# EAGLE design SingleDice (EAGLE 5.11)
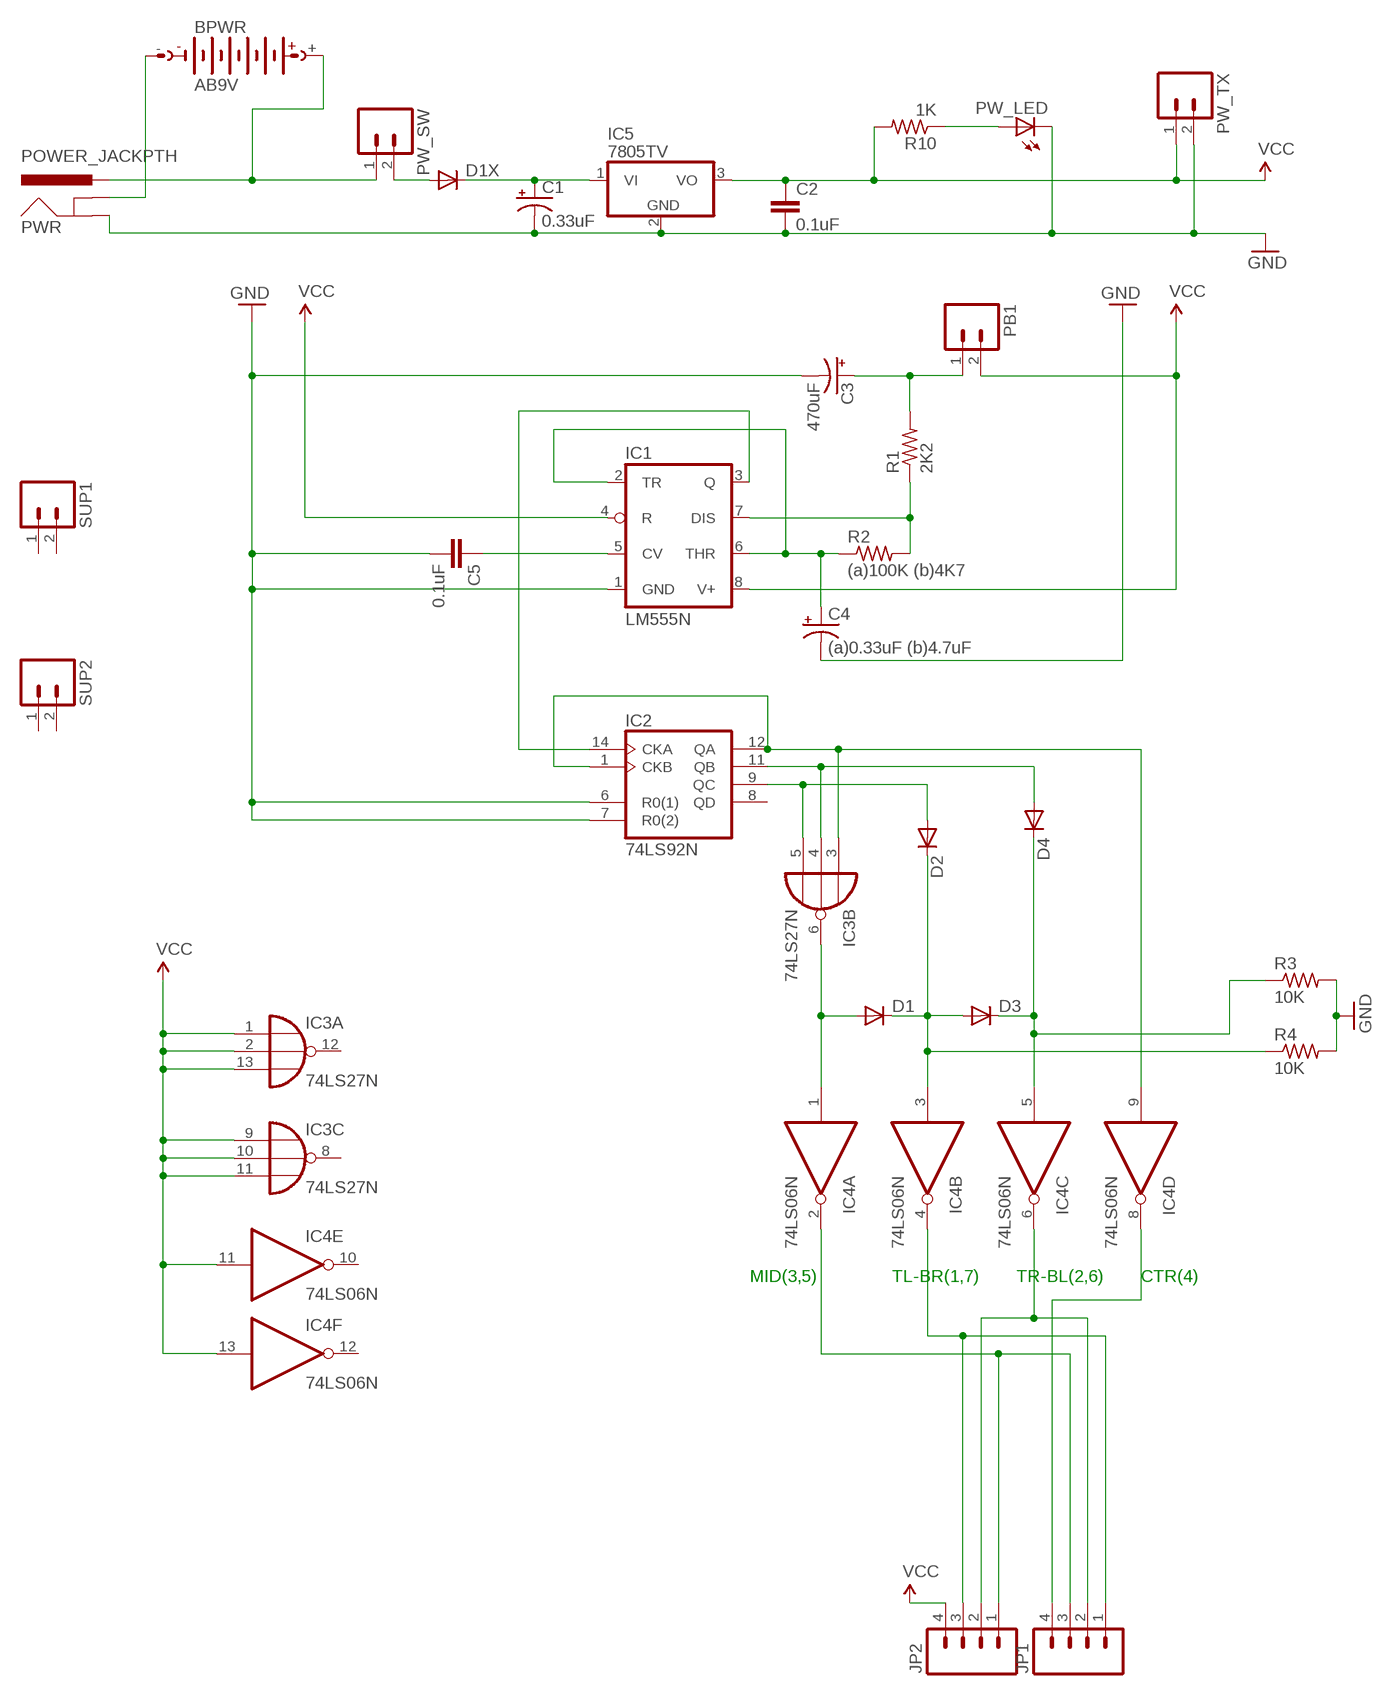
[diagram p0: schematic, sheet 1]

## Parts
BPWR  AB9V  [AB9V]
C1  0.33uF  CAP_POLPTH1  [CPOL-RADIAL-100UF-25V]
C2  0.1uF  CAPPTH  [CAP-PTH-SMALL]
C3  470uF  CAP_POLPTH4  [CPOL-RADIAL-1000UF-25V]
C4  (a)0.33uF (b)4.7uF  CAP_POLPTH1  [CPOL-RADIAL-100UF-25V]
C5  0.1uF  CAPPTH  [CAP-PTH-SMALL]
D1  DIODEPTH  [DIODE-1N4001]
D1X  DIODEPTH  [DIODE-1N4001]
D2  DIODEPTH  [DIODE-1N4001]
D3  DIODEPTH  [DIODE-1N4001]
D4  DIODEPTH  [DIODE-1N4001]
IC1  LM555N  [DIL08-ROUND]
IC2  74LS92N  [DIL14]
IC3  74LS27N  [DIL14]
IC4  74LS06N  [DIL14]
IC5  7805TV  [TO220V]
JP1  M04LOCK  [1X04_LOCK]
JP2  M04LOCK  [1X04_LOCK]
PB1  M02LOCK  [1X02_LOCK]
PW_LED  LED5MM  [LED5MM]
PW_SW  M02LOCK  [1X02_LOCK]
PW_TX  M02LOCK  [1X02_LOCK]
PWR  POWER_JACKPTH  [POWER_JACK_PTH]
R1  2K2  R-US_0207/10  [0207/10]
R2  (a)100K (b)4K7  R-US_0207/10  [0207/10]
R3  10K  R-US_0207/10  [0207/10]
R4  10K  R-US_0207/10  [0207/10]
R10  1K  R-US_0207/10  [0207/10]
SUP1  M02LOCK  [1X02_LOCK]
SUP2  M02LOCK  [1X02_LOCK]

## Nets
DICE1: IC2.1(CKB) IC2.12(QA) IC3.3(B:I0) IC4.9(D:I)
DICE2: D3.C D4.C IC4.5(C:I) R3.1
DICE4: D1.C D2.C D3.A IC4.3(B:I) R4.1
DICE6: D1.A IC3.6(B:O) IC4.1(A:I)
GND: C1.2(-) C2.2 C3.2(-) C4.2(-) C5.2 IC1.1(GND) IC2.6(R0(1)) IC2.7(R0(2)) IC5.2(GND) PW_LED.K(C) PW_TX.2 PWR.GND R3.2 R4.2
L1: IC4.4(B:O) JP1.1 JP2.3
L2: IC4.6(C:O) JP1.2 JP2.2
L3: IC4.2(A:O) JP1.3 JP2.1
L4: IC4.8(D:O) JP1.4
N$1: IC1.3(Q) IC2.14(CKA)
N$2: IC1.7(DIS) R1.1 R2.2
N$3: C5.1 IC1.5(CV)
N$4: C4.1(+) IC1.2(TR) IC1.6(THR) R2.1
N$5: PW_LED.A R10.1
N$6: BPWR.+ PW_SW.1 PWR.PWR
N$7: D4.A IC2.11(QB) IC3.4(B:I1)
N$8: D2.A IC2.9(QC) IC3.5(B:I2)
N$10: C1.1(+) D1X.C IC5.1(VI)
N$22: C3.1(+) PB1.1 R1.2
N$31: BPWR.- PWR.GNDBREAK
N$33: D1X.A PW_SW.2
VCC: C2.1 IC1.4(R) IC1.8(V+) IC3.1(A:I0) IC3.2(A:I1) IC3.9(C:I0) IC3.10(C:I1) IC3.11(C:I2) IC3.13(A:I2) IC4.11(E:I) IC4.13(F:I) IC5.3(VO) JP2.4 PB1.2 PW_TX.1 R10.2
Unconnected: IC2.8(QD) IC3.8(C:O) IC3.12(A:O) IC4.10(E:O) IC4.12(F:O) SUP1.1 SUP1.2 SUP2.1 SUP2.2

## Notes on the sheet
- MID(3,5) | TL-BR(1,7) | TR-BL(2,6) | CTR(4)

## Power pins joined to a net without a drawn wire
GND: IC2.10(GND) IC3.7(P:GND) IC4.7(P:GND)
VCC: IC2.5(VCC) IC3.14(P:VCC) IC4.14(P:VCC)

## Library data of the parts
BPWR = battery:AB9V: 9-V BATTERY CLIP
C1 C3 C4 = SparkFun:CAP_POL: Capacitor Polarized These are standard SMD and PTH capacitors. Normally 10uF, 47uF, and 100uF in electrolytic and tantalum varieties. Always verify the external diameter of the through hole cap, it varies with capacity, voltage, and manufacturer. The EIA devices should be standard.
C2 C5 = SparkFun:CAP: Capacitor Standard 0603 ceramic capacitor, and 0.1" leaded capacitor.
D1 D1X D2-D4 = SparkFun:DIODE: Diode These are standard reverse protection diodes and small signal diodes. SMA package can handle up to about 1A. SOD-323 can handle about 200mA. What the SOD-323 package when ordering, there are some mfgs out there that are 5-pin packages.
IC1 = adafruit:*555: TIMER Changed DIP package to have round (not oval) pin pads http://www.ladyada.net/library/pcb/eaglelibrary.html
IC2 = 74xx-eu:74*92: Decade, divide by twelve and binary COUNTER
IC3 = 74xx-eu:74*27: Triple 3-input NOR gate
IC4 = 74xx-eu:74*06: Hex INVERTER, open collector high-voltage output
IC5 = linear:78*: Positive VOLTAGE REGULATOR Source: http://cache.national.com/ds/LM/LM78L05.pdf http://www.fairchildsemi.com/ds/LM/LM7805.pdf
JP1 JP2 = SparkFun:M04: Header 4 Standard 4-pin 0.1" header. Use with straight break away headers (SKU : PRT-00116), right angle break away headers (PRT-00553), swiss pins (PRT-00743), machine pins (PRT-00117), and female headers (PRT-00115). Molex polarized connector foot print use with SKU : PRT-08231 with associated crimp pins and housings.
PB1 PW_SW PW_TX SUP1 SUP2 = SparkFun:M02: Header 2 Standard 2-pin 0.1" header. Use with straight break away headers (SKU : PRT-00116), right angle break away headers (PRT-00553), swiss pins (PRT-00743), machine pins (PRT-00117), and female headers (PRT-00115). Molex polarized connector foot print use with SKU : PRT-08233 with associated crimp pins and housings.
PW_LED = SparkFun:LED: LEDs Standard schematic elements and footprints for 5mm, 3mm, 1206, and 0603 sized LEDs. 5mm - Spark Fun Electronics SKU : COM-00529 (and others)
PWR = SparkFun:POWER_JACK: Power Jack This is the standard 5.5mm barrel jack for power. The PTH is the most common, proven, reliable, footprint. All others are experimental. The Slot footprint only works if the mill layer is transmitted to the PCB fab house so be warned. Spark Fun Electronics SKU : PRT-00119. Mating wall wart : TOL-00298 (and others)
R1-R4 R10 = adafruit:R-US_: RESISTOR, American symbol

## Board
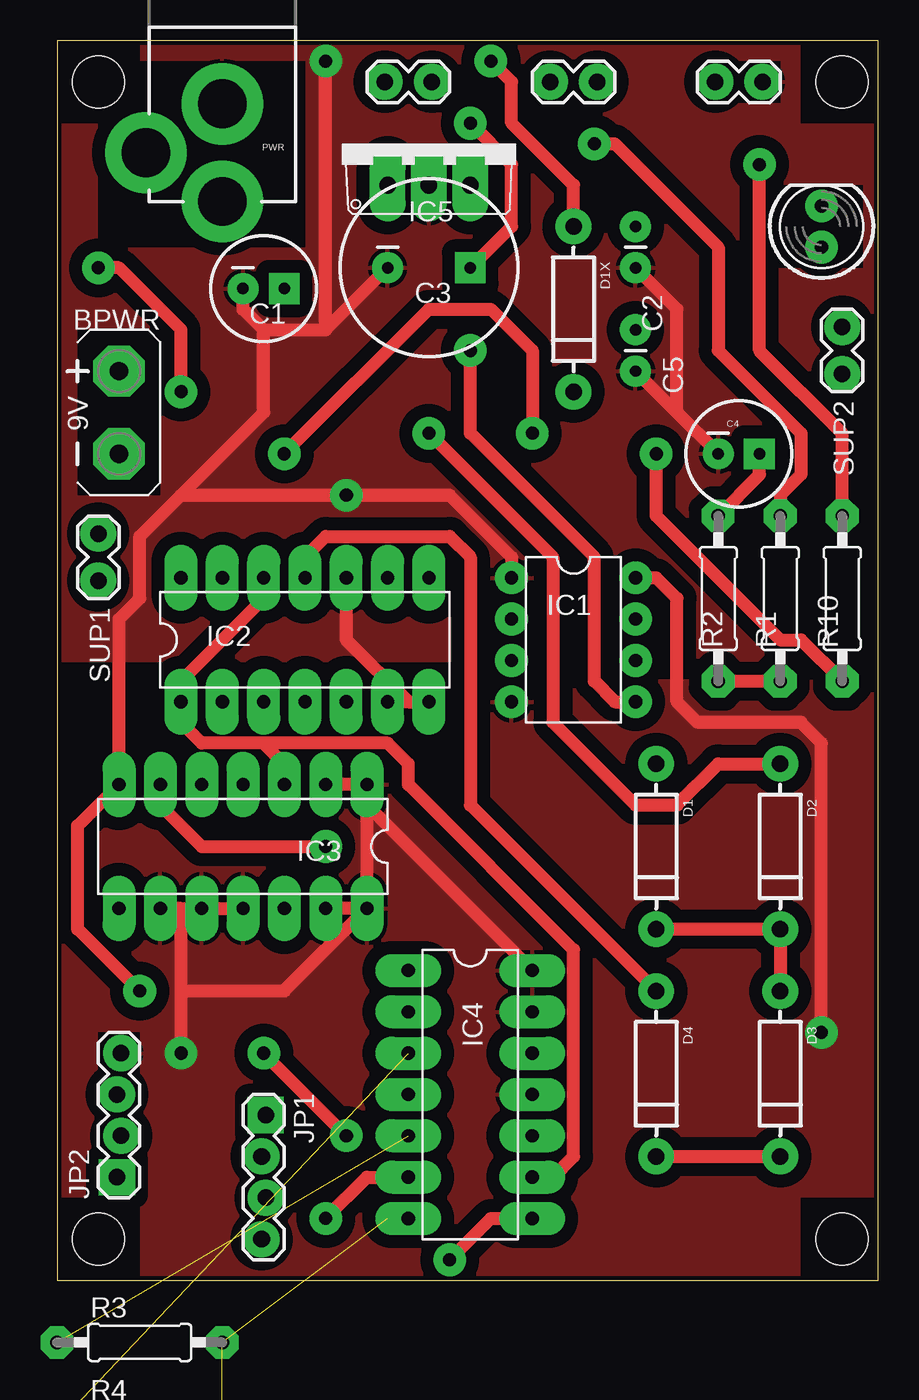
[diagram p1: board, top side]
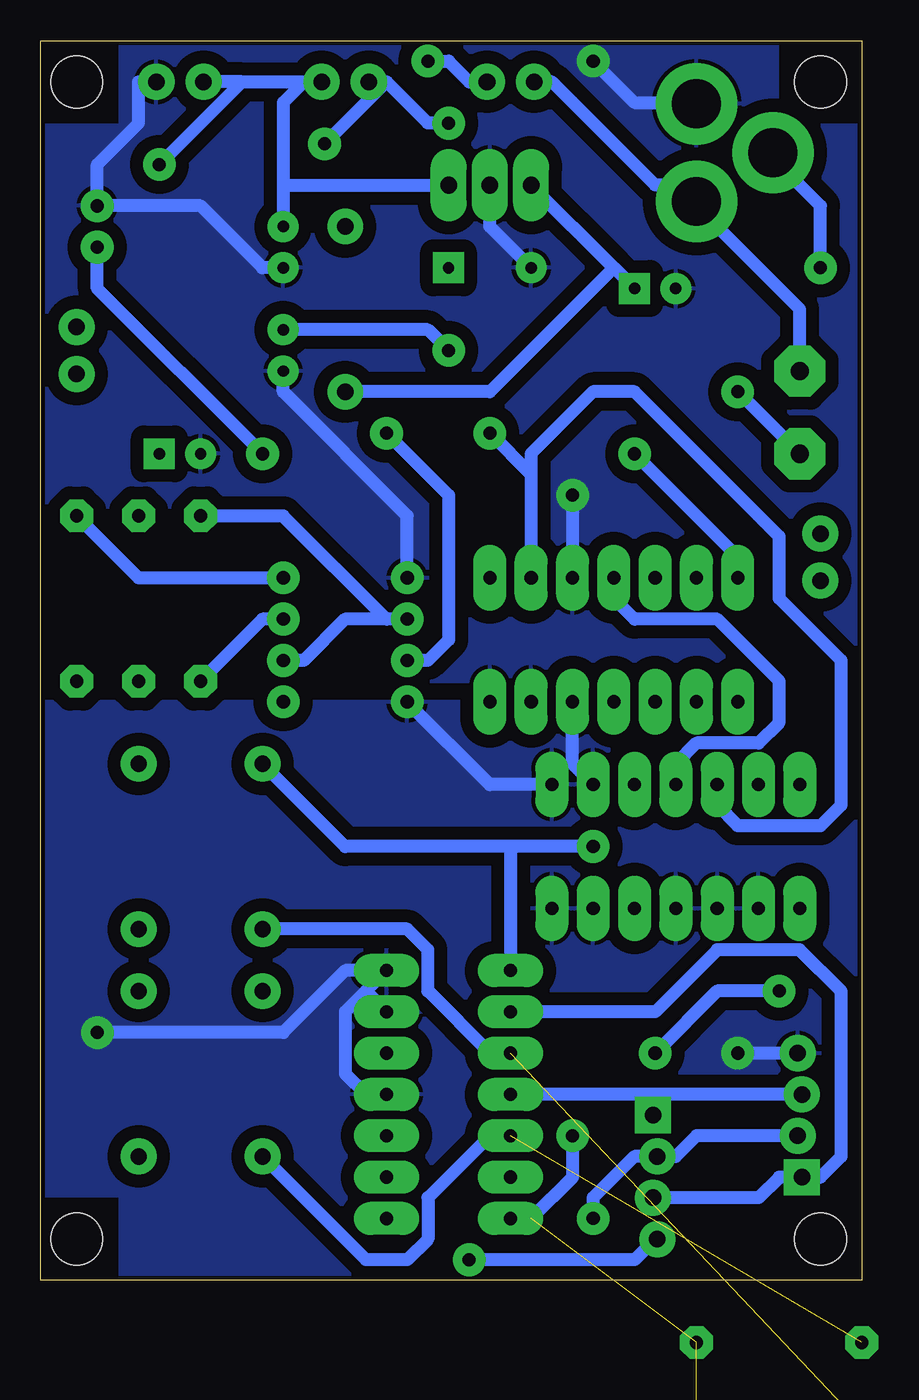
[diagram p2: board, bottom side, seen from below]

Size 50.47 x 76.19 mm. Coordinates in mm from the lower left corner, seen from the top.
Outline: 50.47,0 50.47,76.19 0,76.19 0,0 50.47,0
Copper layers (1*16): Top 0.035mm / dielectric 1.5mm / Bottom 0.035mm
Design rules "hobby": minimum track width 0.8mm, minimum drill 0.8mm, track to track 0.8mm, track to pad 0.8mm, pad to pad 0.45mm, via to via 0.8mm, smd to smd 8mil, copper to edge 10mil, drill to drill 8mil, minimum pad ring 0.6mm, minimum via ring 0.6mm, stop-mask expansion 4mil, vias tented up to drill 25mil, thermal gap 10mil
Holes 3.17 mm at 2.54,2.54 48.26,2.54 48.26,73.66 2.54,73.66
tRestrict: area 0,0 to 5.1,5.1; area 45.7,0 to 50.8,5.1; area 45.7,71.1 to 50.8,76.2; area 0,71.1 to 5.1,76.2; area 2.5,63.5 to 15.2,74.9; area 1.3,48.3 to 6.3,58.4; area 1.3,41.9 to 3.8,47; area 47,54.6 to 49.5,59.7; area 44.5,62.2 to 49.5,67.3; area 19,66 to 26.7,68.6; area 39.4,72.4 to 44.5,74.9; area 29.2,72.4 to 34.3,74.9; area 19.1,72.4 to 24.1,74.9; area 11.4,1.3 to 14,11.4; area 2.5,5.1 to 5.1,15.2
bRestrict: area 0,0 to 5.1,5.1; area 45.7,0 to 50.8,5.1; area 45.7,71.1 to 50.8,76.2; area 0,71.1 to 5.1,76.2

### Footprints (pad centres in the part's own frame; a part is rotated, then mirrored left to right if it is on the bottom)
AB9V = drill 1.118 pad 3.15 octagon: + 0,2.54; - 0,-2.54
CPOL-RADIAL-100UF-25V = drill 0.7 pad 1.651 square: 1 1.27,0 | drill 0.7 pad 1.651 round: 2 -1.27,0
CAP-PTH-SMALL = drill 0.7 pad 1.651 round: 1 0,0; 2 2.54,0
CPOL-RADIAL-1000UF-25V = drill 0.7 pad 1.651 square: 1 2.54,0 | drill 0.7 pad 1.651 round: 2 -2.54,0
DIODE-1N4001 = drill 1 pad 1.981 round: A -5.08,0; C 5.08,0
DIL08-ROUND = drill 0.813 pad 1.676 round: 1 -3.81,-3.81; 2 -1.27,-3.81; 3 1.27,-3.81; 4 3.81,-3.81; 5 3.81,3.81; 6 1.27,3.81; 7 -1.27,3.81; 8 -3.81,3.81
DIL14 = drill 0.813 long: 1 -7.62,-3.81; 2 -5.08,-3.81; 3 -2.54,-3.81; 4 0,-3.81; 5 2.54,-3.81; 6 5.08,-3.81; 7 7.62,-3.81; 8 7.62,3.81; 9 5.08,3.81; 10 2.54,3.81; 11 0,3.81; 12 -2.54,3.81; 13 -5.08,3.81; 14 -7.62,3.81
TO220V = drill 1.016 long: 1 -2.54,-2.54; 2 0,-2.54; 3 2.54,-2.54
1X04_LOCK = drill 1.016 pad 1.88 square: 1 0,0.127 | drill 1.016 pad 1.88 round: 2 2.54,-0.127; 3 5.08,0.127; 4 7.62,-0.127
1X02_LOCK = drill 1.016 pad 1.88 round: 1 -0.178,0; 2 2.718,0
LED5MM = drill 0.813 pad 1.88 round: A -1.27,0; K 1.27,0
POWER_JACK_PTH = drill 2.997 pad 4.318 round: GND 0,7.7; GNDBREAK 4.7,10.7; PWR 0,13.7
0207/10 = drill 0.813 pad 1.676 octagon: 1 -5.08,0; 2 5.08,0

### Placement (x,y rotation side)
BPWR  3.81,53.34 0 top
C1  12.7,60.96 0 top
C2  35.56,64.77 270 top
C3  22.86,62.23 0 top
C4  41.91,50.8 0 top
C5  35.56,58.42 270 top
D1  36.83,26.67 270 top
D1X  31.75,59.69 270 top
D2  44.45,26.67 270 top
D3  44.45,12.7 270 top
D4  36.83,12.7 270 top
IC1  31.75,39.37 270 top
IC2  15.24,39.37 0 top
IC3  11.43,26.67 180 top
IC4  25.4,11.43 270 top
IC5  22.86,69.85 0 top
JP1  12.7,10.16 270 top
JP2  3.81,6.35 90 top
PB1  30.48,73.66 0 top
PW_LED  46.99,64.77 90 top
PW_SW  20.32,73.66 0 top
PW_TX  40.64,73.66 0 top
PWR  10.16,80.01 180 top
R1  44.45,41.91 90 top
R2  40.64,41.91 270 top
R3  5.08,-3.81 0 top  (outside the outline)
R4  5.08,-8.89 0 top  (outside the outline)
R10  48.26,41.91 90 top
SUP1  2.54,43.18 90 top
SUP2  48.26,55.88 90 top

### Tracks (layer width: path | path; a pad name or v marks a point on that pad's centre or on a via)
DICE1
  Top 0.8: IC3.3 13.97,31.75 12.7,33.02 | 12.7,33.02 8.89,33.02 7.62,34.29 IC2.1 7.62,36.83 12.7,41.91 IC2.12 | IC4.9 30.48,6.35 31.75,7.62 31.75,20.32 21.59,30.48 21.59,31.75 20.32,33.02 12.7,33.02
DICE2  (1 unrouted)
  Top 0.8: D4.C D3.C
  Bottom 0.8: IC4.5 22.86,8.89 26.67,5.08 26.67,2.54 27.94,1.27 30.48,1.27 D4.C
DICE4  (1 unrouted)
  Top 0.8: D3.A D2.C D1.C
  Bottom 0.8: IC4.3 22.86,13.97 26.67,17.78 26.67,20.32 27.94,21.59 D1.C
DICE6  (via drill 0.8)
  Top 0.8: IC3.6 6.35,29.21 8.89,26.67 v16.51,26.67
  Bottom 0.8: 21.59,26.67 31.75,26.67 D1.A | v16.51,26.67 21.59,26.67 | 21.59,26.67 IC4.1
GND  (via drill 0.8)  (2 unrouted)
  Top 0.8: C5.2 38.1,53.34 | 38.1,53.34 C4.2 | C2.2 38.1,59.69 38.1,53.34 | 21.59,35.56 IC2.7 | 21.59,35.56 IC2.6 | IC2.10 17.78,39.37 21.59,35.56 | C1.2 11.43,59.69 12.7,58.42 | 12.7,58.42 16.51,58.42 | 16.51,58.42 C3.2 | 7.62,48.26 12.7,53.34 12.7,58.42 | 7.62,48.26 5.08,45.72 5.08,41.91 3.81,40.64 IC3.7 1.27,27.94 1.27,21.59 v5.08,17.78 | v12.7,13.97 v17.78,8.89 | 7.62,48.26 v17.78,48.26 24.13,48.26 27.94,44.45 IC1.1 | 16.51,58.42 v16.51,74.93
  Bottom 0.8: PW_TX.2 44.45,73.66 44.45,71.12 46.99,68.58 PW_LED.K 40.64,66.04 36.83,62.23 C2.2 | IC1.1 27.94,46.99 35.56,54.61 C5.2 | IC4.7 20.32,3.81 17.78,6.35 v17.78,8.89 | v12.7,13.97 8.89,17.78 v5.08,17.78 | IC5.2 22.86,64.77 C3.2 | v17.78,48.26 IC2.10 | v16.51,74.93 13.97,72.39 10.16,72.39 PWR.GND
  pour Bottom: -1.27,77.47 52.07,77.47 52.07,36.83 -1.27,36.83
  pour Top: -1.27,77.47 52.07,77.47 52.07,38.1 -1.27,38.1
L1
  Bottom 0.8: 12.7,11.43 IC4.4 | JP2.3 12.7,11.43 | 12.7,11.43 12.7,10.16 JP1.1
L2  (via drill 0.8)
  Top 0.8: IC4.6 19.05,6.35 v16.51,3.81
  Bottom 0.8: v16.51,3.81 16.51,5.08 13.97,7.62 12.7,7.62 JP1.2 11.43,7.62 10.16,8.89 JP2.2 3.81,8.89
L3
  Bottom 0.8: IC4.2 12.7,16.51 8.89,20.32 3.81,20.32 1.27,17.78 1.27,7.62 2.54,6.35 JP2.1 3.81,6.35 5.08,6.35 6.35,5.08 JP1.3
L4  (via drill 0.8)
  Top 0.8: IC4.8 26.67,3.81 v24.13,1.27
  Bottom 0.8: v24.13,1.27 13.97,1.27 12.7,2.54 JP1.4
N$1  (via drill 0.8)
  Top 0.8: v29.21,52.07 29.21,57.15 26.67,59.69 22.86,59.69 v13.97,50.8
  Bottom 0.8: IC1.3 26.67,38.1 25.4,39.37 25.4,48.26 v29.21,52.07 | v13.97,50.8 7.62,44.45 IC2.14
N$2
  Top 0.8: R2.2 R1.1
  Bottom 0.8: IC1.7 36.83,40.64 R2.2
N$3  (via drill 0.8)
  Top 0.8: v25.4,57.15 25.4,52.07 33.02,44.45 33.02,36.83 34.29,35.56 IC1.5
  Bottom 0.8: C5.1 26.67,58.42 v25.4,57.15
N$4
  Top 0.8: C4.1 43.18,49.53 R2.1
  Bottom 0.8: 29.21,40.64 31.75,40.64 34.29,38.1 IC1.6 | IC1.2 29.21,40.64 | R2.1 35.56,46.99 29.21,40.64
N$5  (via drill 0.8)
  Top 0.8: v36.83,50.8 36.83,46.99 44.45,39.37 45.72,39.37 R10.1
  Bottom 0.8: PW_LED.A 46.99,60.96 v36.83,50.8
N$6
  Bottom 0.8: PW_SW.1 19.05,73.66 12.7,67.31 10.16,67.31 PWR.PWR 10.16,66.04 3.81,59.69 BPWR.+
N$7
  Top 0.8: D4.A 25.4,29.21 25.4,44.45 24.13,45.72 16.51,45.72 15.24,44.45 IC2.11
  Bottom 0.8: IC3.4 11.43,31.75 10.16,33.02 6.35,33.02 5.08,34.29 5.08,36.83 8.89,40.64 13.97,40.64 15.24,41.91 IC2.11
N$8  (via drill 0.8)
  Top 0.8: D2.A 40.64,31.75 38.1,29.21 35.56,29.21 30.48,34.29 30.48,44.45 v22.86,52.07
  Bottom 0.8: IC3.5 8.89,29.21 7.62,27.94 2.54,27.94 1.27,29.21 1.27,38.1 5.08,41.91 5.08,45.72 13.97,54.61 16.51,54.61 20.32,50.8 20.32,49.53 | 20.32,49.53 IC2.9 | 20.32,49.53 v22.86,52.07
N$10
  Bottom 0.8: 15.24,62.23 IC5.1 | C1.1 15.24,62.23 | D1X.C 22.86,54.61 15.24,62.23
N$22  (via drill 0.8)
  Top 0.8: C3.1 27.94,64.77 27.94,68.58 v25.4,71.12 | R1.2 44.45,48.26 45.72,49.53 45.72,52.07 40.64,57.15 40.64,63.5 34.29,69.85 v33.02,69.85
  Bottom 0.8: v25.4,71.12 26.67,71.12 29.21,73.66 | 29.21,73.66 v33.02,69.85 | 29.21,73.66 PB1.1
N$31  (via drill 0.8)
  Top 0.8: v7.62,54.61 7.62,58.42 3.81,62.23 v2.54,62.23
  Bottom 0.8: BPWR.- v7.62,54.61 | v2.54,62.23 2.54,66.04 5.08,68.58 PWR.GNDBREAK
N$33  (via drill 0.8)
  Top 0.8: D1X.A 31.75,67.31 27.94,71.12 27.94,73.66 v26.67,74.93
  Bottom 0.8: v26.67,74.93 25.4,74.93 24.13,73.66 PW_SW.2
VCC  (via drill 0.8)
  Top 0.8: 7.62,22.86 IC3.10 IC3.11 | 7.62,22.86 IC3.9 | 7.62,17.78 7.62,22.86 | v7.62,13.97 7.62,17.78 | IC3.14 IC3.13 | IC3.2 IC3.1 19.05,29.21 | IC3.14 19.05,29.21 | 19.05,29.21 IC4.14 | 7.62,17.78 13.97,17.78 IC3.14 | R10.2 48.26,52.07 43.18,57.15 v43.18,68.58 | v46.99,15.24 46.99,33.02 45.72,34.29 39.37,34.29 38.1,35.56 38.1,41.91 36.83,43.18 IC1.8
  Bottom 0.8: v7.62,13.97 JP2.4 3.81,13.97 | IC4.11 30.48,11.43 31.75,12.7 31.75,16.51 30.48,17.78 | 30.48,17.78 IC4.14 31.75,19.05 35.56,15.24 v46.99,15.24 | 30.48,17.78 IC4.13 | IC2.5 17.78,31.75 IC3.2 | IC1.4 22.86,30.48 IC3.1 | IC1.8 44.45,43.18 R10.2 | 35.56,67.31 35.56,72.39 34.29,73.66 | 35.56,67.31 C2.1 | 35.56,67.31 IC5.3 | 38.1,73.66 34.29,73.66 | 38.1,73.66 PW_TX.1 | 34.29,73.66 PB1.2 | v43.18,68.58 38.1,73.66
  pour Bottom: -1.27,35.56 52.07,35.56 52.07,0 50.8,-1.27 -1.27,-1.27
  pour Top: -1.27,36.83 52.07,36.83 52.07,-1.27 -1.27,-1.27

### Text on the board
_tsilk: 9VDC-C+ | + | + | + | + | Jan 2011 | Nice Dice | Make: Electronics - Exp 23 | 5 6 7 8 | 1 7 | 4 3 2 1